# Altium project PCB_Project1.PrjPCB
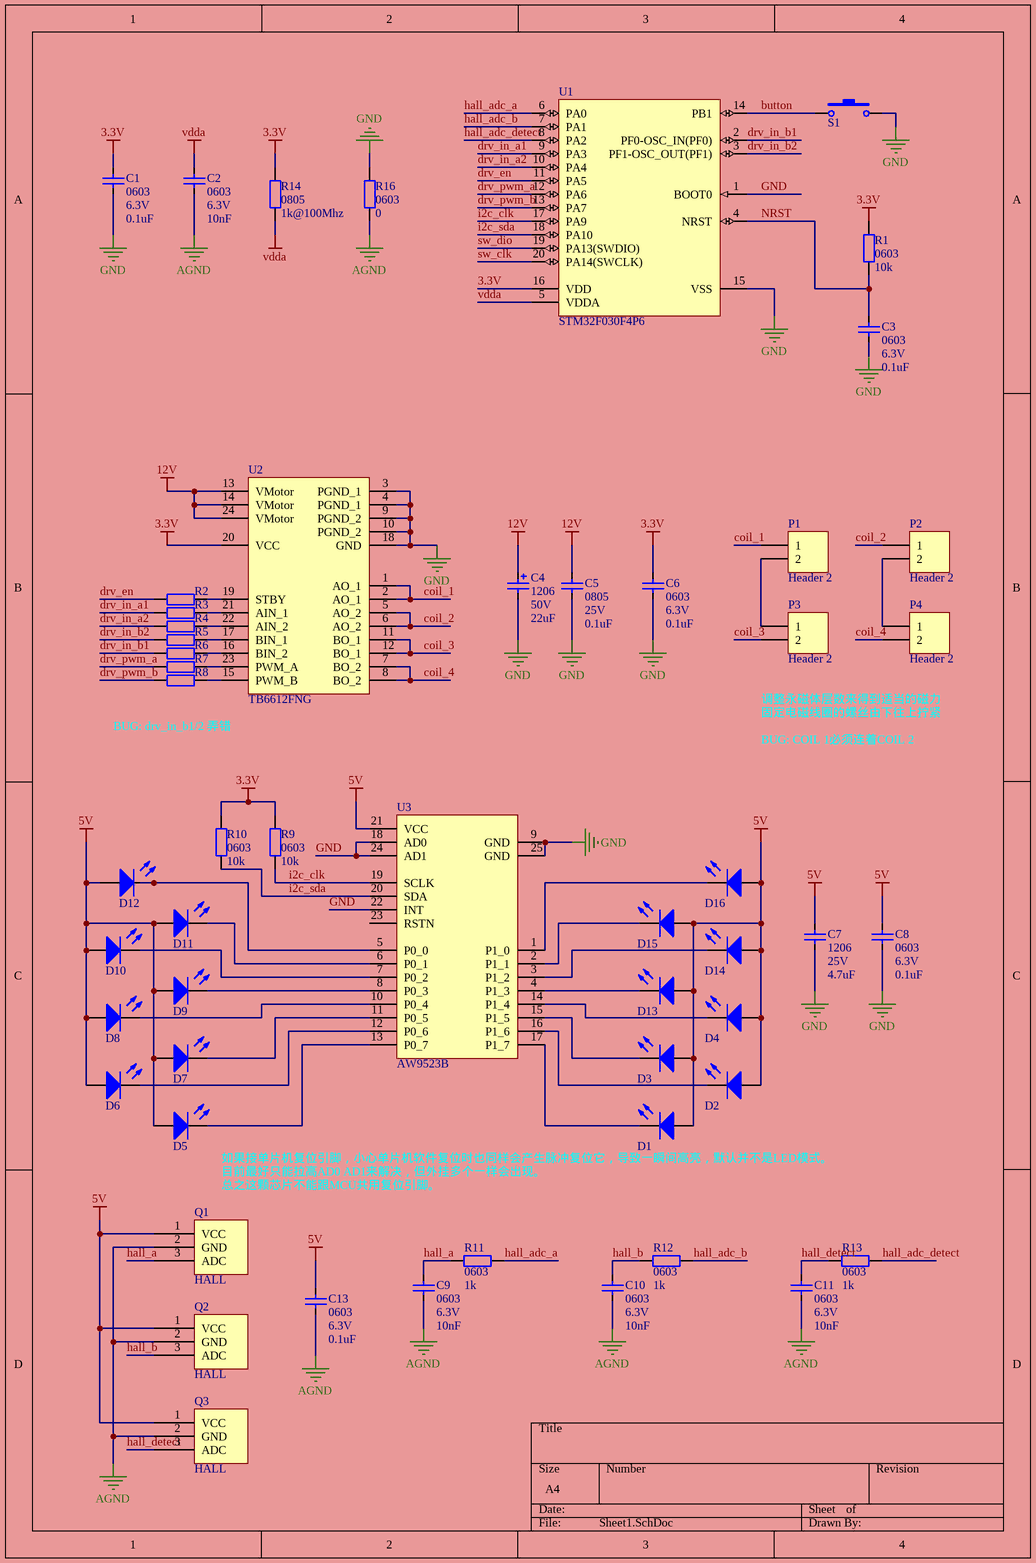
[diagram p0: Sheet1.SchDoc]
2 sheets, 61 parts. Net scope: global (net labels, ports and power ports of the same name join across sheets).
Board file: PCB1.PcbDoc
Sheets:
  Sheet1.SchDoc
  Sheet2.SchDoc

## Sheet Sheet1.SchDoc
size A4 portrait

### Parts
C1  value 0.1uF  Footprint: 0603  Voltage: 6.3V  [C0603]  (hidden comment: CAP_0603)
C2  value 10nF  Footprint: 0603  Voltage: 6.3V  [C0603]  (hidden comment: CAP_0603)
C3  value 0.1uF  Footprint: 0603  Voltage: 6.3V  [C0603]  (hidden comment: CAP_0603)
C4  value 22uF  Footprint: 1206  Voltage: 50V  [C6.3x5.4]  (hidden comment: CAP_Aluminium)
C5  value 0.1uF  Footprint: 0805  Voltage: 25V  [C0805]  (hidden comment: CAP_0805)
C6  value 0.1uF  Footprint: 0603  Voltage: 6.3V  [C0603]  (hidden comment: CAP_0603)
C7  value 4.7uF  Footprint: 1206  Voltage: 25V  [C1206]  (hidden comment: CAP_1206)
C8  value 0.1uF  Footprint: 0603  Voltage: 6.3V  [C0603]  (hidden comment: CAP_0603)
C9  value 10nF  Footprint: 0603  Voltage: 6.3V  [C0603]  (hidden comment: CAP_0603)
C10  value 10nF  Footprint: 0603  Voltage: 6.3V  [C0603]  (hidden comment: CAP_0603)
C11  value 10nF  Footprint: 0603  Voltage: 6.3V  [C0603]  (hidden comment: CAP_0603)
C13  value 0.1uF  Footprint: 0603  Voltage: 6.3V  [C0603]  (hidden comment: CAP_0603)
D1  LED  [LED_DIP]  (value not drawn)
D2  LED  [LED_DIP]  (value not drawn)
D3  LED  [LED_DIP]  (value not drawn)
D4  LED  [LED_DIP]  (value not drawn)
D5  LED  [LED_DIP]  (value not drawn)
D6  LED  [LED_DIP]  (value not drawn)
D7  LED  [LED_DIP]  (value not drawn)
D8  LED  [LED_DIP]  (value not drawn)
D9  LED  [LED_DIP]  (value not drawn)
D10  LED  [LED_DIP]  (value not drawn)
D11  LED  [LED_DIP]  (value not drawn)
D12  LED  [LED_DIP]  (value not drawn)
D13  LED  [LED_DIP]  (value not drawn)
D14  LED  [LED_DIP]  (value not drawn)
D15  LED  [LED_DIP]  (value not drawn)
D16  LED  [LED_DIP]  (value not drawn)
P1  Header 2  [HDR1X2]
P2  Header 2  [HDR1X2]
P3  Header 2  [HDR1X2]
P4  Header 2  [HDR1X2]
Q1  HALL  [HALL_3503_TO-92]
Q2  HALL  [HALL_3503_TO-92]
Q3  HALL  [HALL_3503_TO-92]
R1  value 10k  Footprint: 0603  [R0603]  (hidden comment: RES_0603)
R2  RES_0603  [R0603]  (value not drawn)
R3  RES_0603  [R0603]  (value not drawn)
R4  RES_0603  [R0603]  (value not drawn)
R5  RES_0603  [R0603]  (value not drawn)
R6  RES_0603  [R0603]  (value not drawn)
R7  RES_0603  [R0603]  (value not drawn)
R8  RES_0603  [R0603]  (value not drawn)
R9  value 10k  Footprint: 0603  [R0603]  (hidden comment: RES_0603)
R10  value 10k  Footprint: 0603  [R0603]  (hidden comment: RES_0603)
R11  value 1k  Footprint: 0603  [R0603]  (hidden comment: RES_0603)
R12  value 1k  Footprint: 0603  [R0603]  (hidden comment: RES_0603)
R13  value 1k  Footprint: 0603  [R0603]  (hidden comment: RES_0603)
R14  value 1k@100Mhz  Footprint: 0805  [R0805]  (hidden comment: RES_0805)
R16  value 0  Footprint: 0603  [R0603]  (hidden comment: RES_0603)
S1  BUTTON  [BUTTON_6X6]  (value not drawn)
U1  STM32F030F4P6  [STM-TSSOP20_N]
U2  TB6612FNG  [TB6612FNG]
U3  AW9523B  [AW9523B]

### Nets
3.3V: C1.2 C6.2 R1.2 R9.2 R10.2 R14.2 U1.16(VDD) U2.20(VCC)
5V: C7.2 C8.2 C13.2 D1.1 D2.1 D3.1 D4.1 D5.1 D6.1 D7.1 D8.1 D9.1 D10.1 D11.1 D12.1 D13.1 D14.1 D15.1 D16.1 Q1.1(VCC) Q2.1(VCC) Q3.1(VCC) U3.21(VCC)
12V: C4.1 C5.2 U2.13(VMotor) U2.14(VMotor) U2.24(VMotor)
AGND: C2.1 C9.2 C10.2 C11.2 C13.1 Q1.2(GND) Q2.2(GND) Q3.2(GND) R16.1
GND: C1.1 C3.1 C4.2 C5.1 C6.1 C7.1 C8.1 R16.2 S1.2 U1.1(BOOT0) U1.15(VSS) U2.3(PGND_1) U2.4(PGND_1) U2.9(PGND_2) U2.10(PGND_2) U2.18(GND) U3.9(GND) U3.18(AD0) U3.22(INT) U3.24(AD1) U3.25(GND)
vdda: C2.2 R14.1 U1.5(VDDA)
button: S1.1 U1.14(PB1)
coil_1: P1.1 U2.1(AO_1) U2.2(AO_1)
coil_2: P2.1 U2.5(AO_2) U2.6(AO_2)
coil_3: P3.2 U2.11(BO_1) U2.12(BO_1)
coil_4: P4.2 U2.7(BO_2) U2.8(BO_2)
drv_en: R2.2 U1.11(PA5)
drv_in_a1: R3.2 U1.9(PA3)
drv_in_a2: R4.2 U1.10(PA4)
drv_in_b1: R6.2 U1.2(PF0-OSC_IN(PF0))
drv_in_b2: R5.2 U1.3(PF1-OSC_OUT(PF1))
drv_pwm_a: R7.2 U1.12(PA6)
drv_pwm_b: R8.2 U1.13(PA7)
hall_a: C9.1 Q1.3(ADC) R11.1
hall_adc_a: R11.2 U1.6(PA0)
hall_adc_b: R12.2 U1.7(PA1)
hall_adc_detect: R13.2 U1.8(PA2)
hall_b: C10.1 Q2.3(ADC) R12.1
hall_detect: C11.1 Q3.3(ADC) R13.1
i2c_clk: R9.1 U1.17(PA9) U3.19(SCLK)
i2c_sda: R10.1 U1.18(PA10) U3.20(SDA)
NRST: C3.2 R1.1 U1.4(NRST)
sw_clk: U1.20(PA14(SWCLK))
sw_dio: U1.19(PA13(SWDIO))
NetD1_2: D1.2 U3.17(P1_7)
NetD2_2: D2.2 U3.16(P1_6)
NetD3_2: D3.2 U3.15(P1_5)
NetD4_2: D4.2 U3.14(P1_4)
NetD5_2: D5.2 U3.13(P0_7)
NetD6_2: D6.2 U3.12(P0_6)
NetD7_2: D7.2 U3.11(P0_5)
NetD8_2: D8.2 U3.10(P0_4)
NetD9_2: D9.2 U3.8(P0_3)
NetD10_2: D10.2 U3.7(P0_2)
NetD11_2: D11.2 U3.6(P0_1)
NetD12_2: D12.2 U3.5(P0_0)
NetD13_2: D13.2 U3.4(P1_3)
NetD14_2: D14.2 U3.3(P1_2)
NetD15_2: D15.2 U3.2(P1_1)
NetD16_2: D16.2 U3.1(P1_0)
NetP1_2: P1.2 P3.1
NetP2_2: P2.2 P4.1
NetR2_1: R2.1 U2.19(STBY)
NetR3_1: R3.1 U2.21(AIN_1)
NetR4_1: R4.1 U2.22(AIN_2)
NetR5_1: R5.1 U2.17(BIN_1)
NetR6_1: R6.1 U2.16(BIN_2)
NetR7_1: R7.1 U2.23(PWM_A)
NetR8_1: R8.1 U2.15(PWM_B)

Not connected (* = marked no-connect by the designer): U3 23(RSTN)

### Notes on the sheet
- 调整永磁体层数来得到适当的磁力
- BUG: drv_in_b1/2 弄错
- 固定电磁线圈的螺丝由下往上拧紧
- BUG: COIL 1必须连着COIL 2
- (near D5) 如果接单片机复位引脚，小心单片机软件复位时也同样会产生脉冲复位它，导致一瞬间高亮，默认并不是LED模式。
- 目前最好只能拉高AD0 AD1来解决，但外挂多个一样会出现。
- 总之这颗芯片不能跟MCU共用复位引脚。

### Library data of the parts
C1-C3 C6 C8-C11 C13 = CAP_0603: Capacitor 0603
C4 = CAP_Aluminium: aluminium electrolysis; Accuracy: 10%
C5 = CAP_0805: Capacitor 0805
C7 = CAP_1206: Capacitor 1206
D1-D16 = LED_DIP
P1-P4 = Header 2: Header, 2-Pin; LatestRevisionDate: 17-Jul-2002; LatestRevisionNote: Re-released for DXP Platform.; Publisher: Altium Limited
Q1-Q3 = SS49E_3503: HALL SS49E 3503
R1 R9-R13 R16 = RES_0603: Resister; Precision: 1%
R2-R8 = RES_0603: Resister; Value: 10k; Precision: 1%; Footprint: 0603
R14 = RES_0805: Resister; Precision: 1%
S1 = BUTTON_6x6: BUTTON_1_6mm X 6mm SMT
U1 = STM32F030F4P6: ARM Cortex-M0 32-bit MCU, 16 KB Flash, 4 KB Internal RAM, 15 I/Os, 20-pin TSSOP, -40 to 85 degC, Tube; FLASH Size (Prog) (kB): 16; I/Os (High Current): 15; Internal RAM Size (kB): 4; Operating Frequency(F) (Processor speed) (MHz): 48; Supply Voltage(Vcc) min (V): 2.4; DatasheetVersion: Rev. 1; PackageVersion: Rev. 1, 11/2012; PackageReference: TSSOP20; PackageDescription: 20-Pin Thin Shrink Small Outline Package, 6.5 x 4.4 mm Body, 0.65 mm Pitch; Supplier 1: Digi-Key; Supplier Part Number 1: 497-14044-5-ND; Supplier 2: Newark; Supplier Part Number 2: 06X3648; Supplier 3: Mouser; Supplier Part Number 3: 511-STM32F030F4P6; Core: ARM Cortex-M0; Packing: Tube; Mounting Technology: Surface Mount; PartNumber: STM32F030F4P6; ComponentLink1Description: Manufacturer URL; ComponentLink1URL: http://www.st.com/web/en/home.html; ComponentLink2Description: Datasheet; ComponentLink2URL: http://www.st.com/st-web-ui/static/active/en/resource/technical/document/datasheet/DM00088500.pdf; ComponentLink3Description: Package Specification; ComponentLink3URL: http://www.st.com/st-web-ui/static/active/en/resource/technical/document/datasheet/DM00065136.pdf
U2 = TB6612FNG: MOS driver; LatestRevisionDate: 17-Jul-2002; LatestRevisionNote: Re-released for DXP Platform.; Publisher: Altium Limited
U3 = AW9523B: led driver

## Sheet Sheet2.SchDoc
size A4 portrait
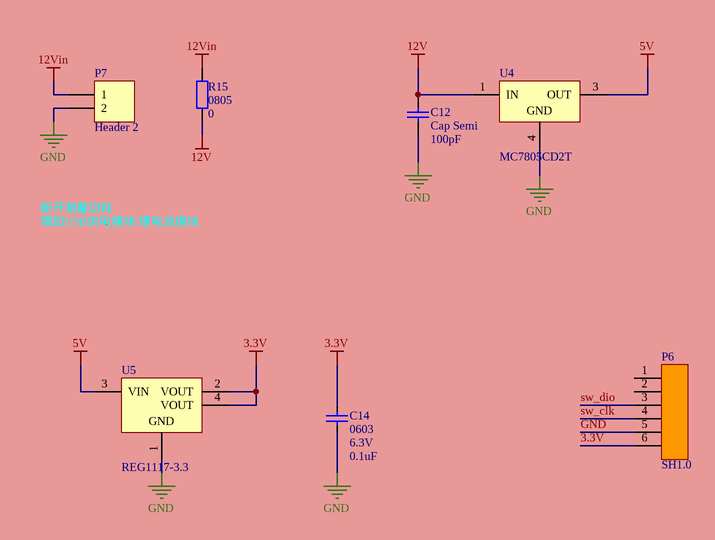
[diagram p1: Sheet2.SchDoc]

### Parts
C12  Cap Semi  value 100pF  [C1206]
C14  value 0.1uF  Footprint: 0603  Voltage: 6.3V  [C0603]  (hidden comment: CAP_0603)
P6  SH1.0  [SH1.0_6_PIN]
P7  Header 2  [HDR1X2]
R15  value 0  Footprint: 0805  [R0805]  (hidden comment: RES_0805)
U4  MC7805CD2T  [936-03]
U5  REG1117-3.3  [TI-DCY4_N]

### Nets
3.3V: C14.2 P6.6 U5.2(VOUT) U5.4(VOUT)
5V: U4.3(OUT) U5.3(VIN)
12V: C12.1 R15.1 U4.1(IN)
12Vin: P7.1 R15.2
GND: C12.2 C14.1 P6.5 P7.2 U4.4(GND) U5.1(GND)
sw_clk: P6.4
sw_dio: P6.3

Not connected (* = marked no-connect by the designer): P6 1 2

### Notes on the sheet
- 断开测量功耗
- 增加USB供电模块/锂电池模块

### Library data of the parts
C12 = Cap Semi: Capacitor (Semiconductor SIM Model); Published: 8-Jun-2000; LatestRevisionDate: 29-May-2009; LatestRevisionNote: IPC-7351 Footprint Added.; PackageReference: C1206; Publisher: Altium Limited; PackageDescription: Chip Capacitor
C14 = CAP_0603: Capacitor 0603
P6 = SH1.0_6_PIN: 1.0mm connector
P7 = Header 2: Header, 2-Pin; LatestRevisionDate: 17-Jul-2002; LatestRevisionNote: Re-released for DXP Platform.; Publisher: Altium Limited
R15 = RES_0805: Resister; Precision: 1%
U4 = MC7805CD2T: Three-Terminal Positive Voltage Regulator; Note: Pin 2 is electrically connected to Pin 4; Pin 2 is trimmed and not drawn;; Published: 15-Apr-2002; DatasheetVersion: 1997; PackageVersion: 1997; PackageReference: 936-03; Publisher: Altium Limited; PackageDescription: D2-PAK/TO-263-AB; 3 Leads (1 Cropped); Body 14.7 (inc. leads) x 10.2 mm (LxW max); ComponentLink1Description: Manufacturer Link; ComponentLink1URL: http://www.onsemi.com/site/products/taxonomy/0,4438,503,00.html; ComponentLink2Description: Datasheet; ComponentLink2URL: http://www.onsemi.com/pub/Collateral/MC7800-D.PDF
U5 = REG1117-3.3: Single Output LDO, 800 mA, Fixed 3.3 V Output, 3.8 to 15 V Input, with Internal Current Limiting, 4-pin SOT-223 (DCY), -40 to 125 degC, Green (RoHS & no Sb/Br); Manufacturer: Texas Instruments; Fixed Output Options(V): 5; Iout(Max)(A): 0.8; Iq(Typ)(mA): 4; Rating: Catalog; SubFamily: Single Channel LDO; Vdo(Typ)(mV): 1100; Vin(Max)(V): 15; Vin(Min)(V): 3.8; Vout Adj(Max)(V): 3.3; DatasheetVersion: SBVS001D; PackageVersion: 4202506/B; PackageReference: DCY4; PackageDescription: 4-Pin Plastic Small Outline, Body 3.5 x 6.5 mm, Pitch 2.3 mm; Supplier 1: Digi-Key; Supplier Part Number 1: REG1117-3.3-ND; Supplier 2: Farnell; Supplier Part Number 2: 1212355; Supplier 3: Farnell; Supplier Part Number 3: 2126471; Supplier 4: Newark; Supplier Part Number 4: 35C1963; Supplier 5: Mouser; Supplier Part Number 5: 595-REG1117-3.3; Eco-Plan: Green (RoHS & no Sb/Br); Vout Adj(Min)(V): 3.3; Mounting Technology: Surface Mount; Code_JEDEC: TO-261; PartNumber: REG1117-3.3; ComponentLink1Description: Manufacturer URL; ComponentLink1URL: http://www.ti.com/; ComponentLink2Description: Datasheet; ComponentLink2URL: http://www.ti.com/general/docs/lit/getliterature.tsp?genericPartNumber=REG1117-33&fileType=pdf; ComponentLink3Description: Package Specification; ComponentLink3URL: http://www.ti.com/litv/pdf/mpds094a

## Nets that join several sheets
3.3V: Sheet1 (8 pins), Sheet2 (C14.2 P6.6 U5.2 U5.4)
5V: Sheet1 (23 pins), Sheet2 (U4.3 U5.3)
12V: Sheet1 (5 pins), Sheet2 (C12.1 R15.1 U4.1)
GND: Sheet1 (21 pins), Sheet2 (6 pins)
sw_clk: Sheet1 (U1.20), Sheet2 (P6.4)
sw_dio: Sheet1 (U1.19), Sheet2 (P6.3)